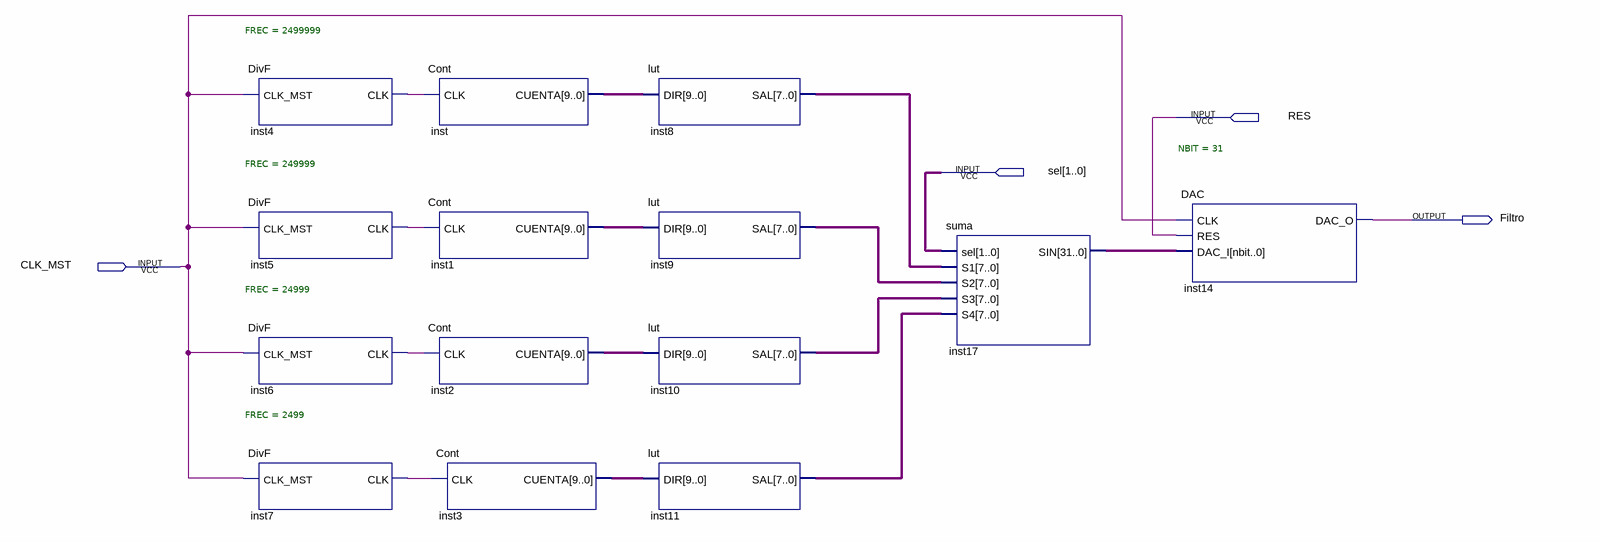
[diagram p0: schematic sheet]
// Quartus schematic Practica4.bdf as structural Verilog: 14 symbols, 4 pins
module Practica4 (
  input  RES,
  input  [1:0] sel,
  input  CLK_MST,
  output Filtro
);

  wire inst4_clk, inst5_clk, inst6_clk, inst7_clk;
  wire [7:0] inst8_sal, inst9_sal, inst10_sal, inst11_sal;
  wire [9:0] inst1_cuenta, inst2_cuenta, inst3_cuenta, inst_cuenta;
  wire [31:0] inst17_sin;

  DivF #(.FREC(2499999)) inst4 (.CLK_MST(CLK_MST), .CLK(inst4_clk));
  DivF #(.FREC(249999)) inst5 (.CLK_MST(CLK_MST), .CLK(inst5_clk));
  DivF #(.FREC(24999)) inst6 (.CLK_MST(CLK_MST), .CLK(inst6_clk));
  DivF #(.FREC(2499)) inst7 (.CLK_MST(CLK_MST), .CLK(inst7_clk));
  Cont inst (.CLK(inst4_clk), .CUENTA(inst_cuenta));
  Cont inst1 (.CLK(inst5_clk), .CUENTA(inst1_cuenta));
  Cont inst2 (.CLK(inst6_clk), .CUENTA(inst2_cuenta));
  Cont inst3 (.CLK(inst7_clk), .CUENTA(inst3_cuenta));
  lut inst8 (.DIR(inst_cuenta), .SAL(inst8_sal));
  lut inst9 (.DIR(inst1_cuenta), .SAL(inst9_sal));
  lut inst10 (.DIR(inst2_cuenta), .SAL(inst10_sal));
  lut inst11 (.DIR(inst3_cuenta), .SAL(inst11_sal));
  suma inst17 (.sel(sel), .S1(inst8_sal), .S2(inst9_sal), .S3(inst10_sal), .S4(inst11_sal), .SIN(inst17_sin));
  DAC #(.NBIT(31)) inst14 (.CLK(CLK_MST), .RES(RES), .DAC_I(inst17_sin), .DAC_O(Filtro));
endmodule
